# EAGLE design true-bypass (EAGLE 7.3.0)
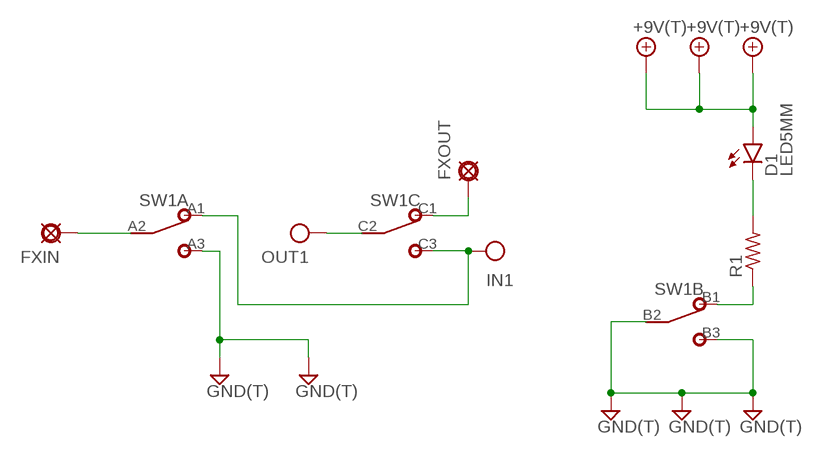
[diagram p0: schematic, sheet 1]

## Parts
+9V1  +9V(T)  [SQUARE]
+9V2  +9V(T)  [SQUARE]
+9V3  +9V(T)  [SQUARE]
D1  LED5MM  [LED5MM]
FXIN  PAD  [SQUARE]
FXOUT  PAD  [SQUARE]
GND1  GND(T)  [SQUARE]
GND2  GND(T)  [SQUARE]
GND3  GND(T)  [SQUARE]
GND4  GND(T)  [SQUARE]
GND5  GND(T)  [SQUARE]
IN1  IN(T)  [SQUARE]
OUT1  OUT(T)  [SQUARE]
R1  6MM.3  [R0207/3]
SW1  3PDTBLUE  [CHINABLUE]

## Nets
+9V: +9V1.1(+9V) +9V2.1(+9V) +9V3.1(+9V) D1.A
GND: GND1.1(GND) GND2.1(GND) GND3.1(GND) GND4.1(GND) GND5.1(GND) SW1.A3 SW1.B2 SW1.B3
IN: IN1.1(IN) SW1.A1 SW1.C3
N$1: FXIN.1(PAD) SW1.A2
N$2: D1.K(C) R1.2
N$3: R1.1 SW1.B1
N$4: FXOUT.1(PAD) SW1.C1
OUT: OUT1.1(OUT) SW1.C2

## Library data of the parts
+9V1-+9V3 = gm-supply:+9V(T): +9V Voltage Supply use this to hook up +9v throughout a schematic instead of running wire automatically labels the net "+9v" adds a hookup pad to the circuit board
D1 = gm-diodes:LED
FXIN FXOUT = gm-supply:PAD: PAD use this package for pads with any purpose, including input, output, send or return various pad shapes: round, square, octogonal, long, and long offset
GND1-GND5 = gm-supply:GND(T): Ground use this to hook up ground (GND) throughout a schematic instead of running wire automatically labels the net "GND" adds a hookup pad to the circuit board (you can use several)
IN1 = gm-supply:IN(T): Input obsolete: use Pad instead and label net shematic input label with circuit board terminal/pad generally used only once on a schematic (because this device labels the net "IN" in the same way as a voltage supply or ground net)
OUT1 = gm-supply:OUT(T): Output obsolete: use Pad instead and label net output label with circuit board terminal/pad usually appears only once on a schematic
R1 = gm-resistors:6MM: 6mm Resistors Leads spaced 1-6 holes apart for 0.1" perfboard. Suitable for 1/4 watt resistors.
SW1 = gm-switches:3PDT

## Board
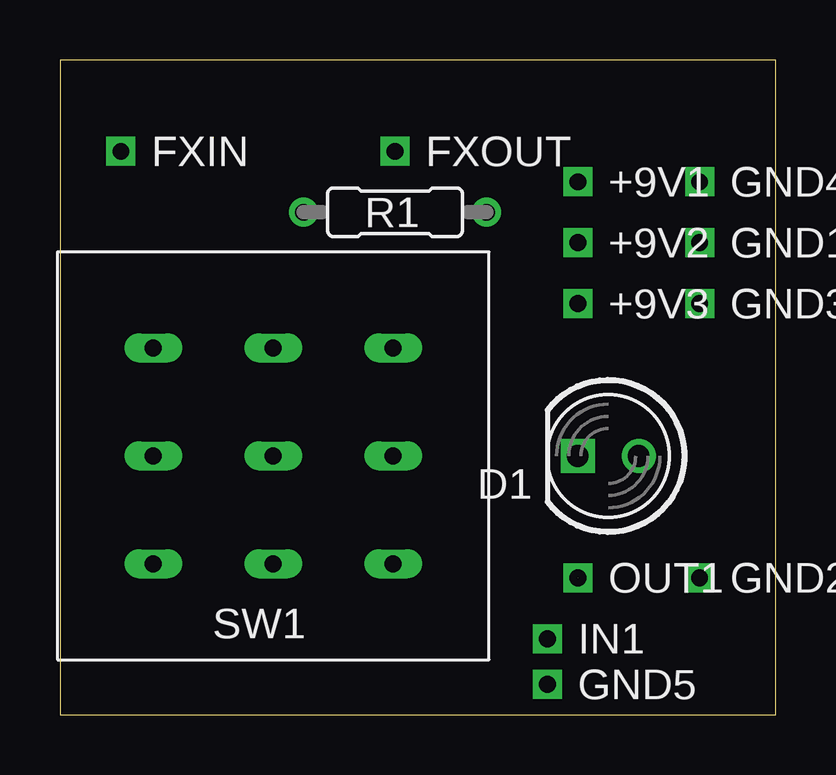
[diagram p1: board, top side]
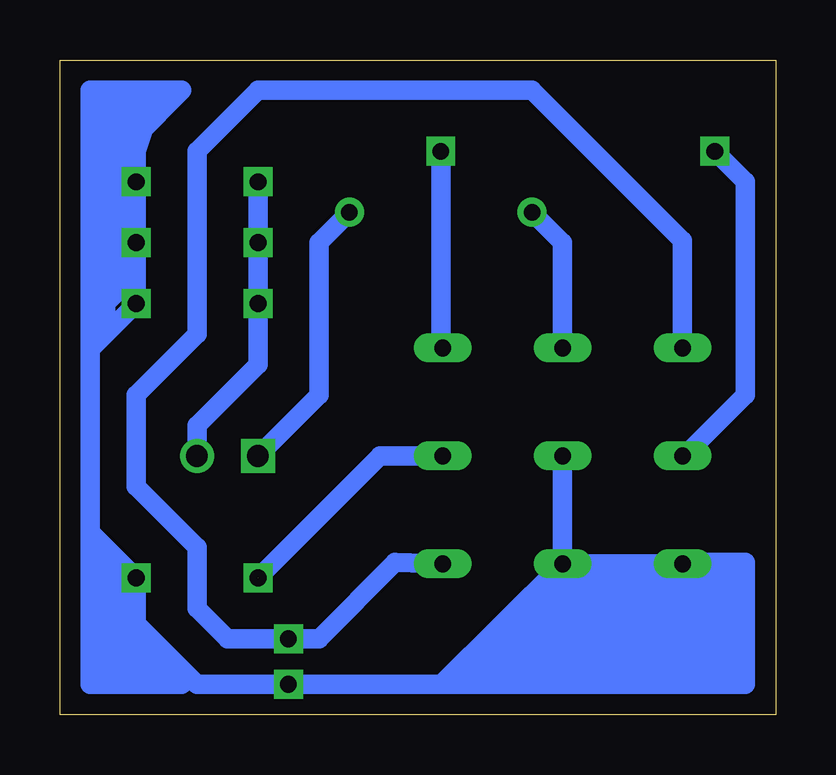
[diagram p2: board, bottom side, seen from below]

Size 29.84 x 27.3 mm. Coordinates in mm from the lower left corner, seen from the top.
Outline: 0,0 29.84,0 29.84,27.3 0,27.3 0,0
Copper layers (1*16): Top 0.035mm / dielectric 1.5mm / Bottom 0.035mm
Design rules "default": minimum track width 10mil, minimum drill 24mil, track to track 8mil, track to pad 8mil, pad to pad 8mil, via to via 8mil, smd to smd 8mil, copper to edge 40mil, drill to drill 8mil, minimum pad ring 10mil, minimum via ring 8mil, stop-mask expansion 4mil, vias tented up to drill 0mil, thermal gap 10mil

### Footprints (pad centres in the part's own frame; a part is rotated, then mirrored left to right if it is on the bottom)
SQUARE = drill 0.7 square: 1 0,0
LED5MM = drill 0.9: A -1.27,0 | drill 0.9 square: K 1.27,0
R0207/3 = drill 0.7: 1 -3.81,0; 2 3.81,0
CHINABLUE = drill 0.7 long: A1 -5,4.5; A2 -5,0; A3 -5,-4.5; B1 0,4.5; B2 0,0; B3 0,-4.5; C1 5,4.5; C2 5,0; C3 5,-4.5

### Placement (x,y rotation side)
+9V1  21.59,22.23 0 top
+9V2  21.59,19.68 0 top
+9V3  21.59,17.14 0 top
D1  22.86,10.79 180 top
FXIN  2.54,23.5 0 top
FXOUT  13.97,23.5 0 top
GND1  26.67,19.68 0 top
GND2  26.67,5.71 0 top
GND3  26.67,17.14 0 top
GND4  26.67,22.23 0 top
GND5  20.32,1.27 0 top
IN1  20.32,3.17 0 top
OUT1  21.59,5.71 0 top
R1  13.97,20.95 0 top
SW1  8.89,10.79 0 top

### Tracks (layer width: path | path; a pad name or v marks a point on that pad's centre or on a via)
+9V
  Bottom 0.813: +9V1.1 +9V2.1 +9V3.1 21.59,14.61 24.13,12.06 D1.A
GND
  Bottom 0.813: SW1.B2 SW1.B3 | SW1.A3 SW1.B3 | GND4.1 GND1.1 | GND1.1 GND3.1 28.57,15.24 | 28.57,15.24 28.57,7.62 | GND1.1 26.67,23.5 | 26.67,23.5 26.67,24.13 | 26.67,24.13 24.77,26.04 26.67,26.04 | 26.67,26.04 26.67,24.77 | 26.67,24.77 26.67,24.13 | 26.67,23.5 26.04,25.4 26.67,24.77 | 26.67,26.04 28.57,26.04 28.57,16.51 | 28.57,15.24 28.57,16.51 | 28.57,16.51 27.3,17.78 27.3,25.4 27.94,25.4 27.94,16.51 | 28.57,7.62 GND2.1 26.67,3.81 24.13,1.27 GND5.1 13.97,1.27 | SW1.B3 13.97,1.27 | 24.77,1.27 28.57,1.27 28.57,6.99 | 28.57,6.99 27.3,5.71 27.3,3.81 26.67,3.17 | 26.67,3.17 25.4,1.91 27.94,1.91 27.94,3.81 | 27.94,5.71 27.94,3.81 | 27.94,3.81 26.67,2.54 27.3,2.54 26.67,3.17 | 28.57,6.99 28.57,7.62 | 13.97,1.27 3.81,1.27 | 3.81,5.08 3.81,5.71 8.89,5.71 12.7,1.91 4.45,1.91 4.45,5.08 8.26,5.08 8.89,4.45 | 8.89,4.45 9.53,4.45 11.43,2.54 5.08,2.54 5.08,4.45 8.26,4.45 | 8.26,4.45 8.89,5.08 8.89,4.45 | 8.89,4.45 10.16,3.17 5.71,3.17 5.71,3.81 8.89,3.81 8.26,4.45 | 3.81,6.35 1.27,6.35 1.27,1.27 3.81,1.27 | 3.81,1.27 3.81,5.08 | 3.81,5.08 3.17,5.71 1.91,5.71 1.91,1.91 2.54,1.91 | 2.54,1.91 3.17,1.91 3.17,5.08 2.54,5.08 2.54,1.91
IN
  Bottom 0.813: SW1.A1 3.89,19.77 10.16,26.04 21.59,26.04 24.13,23.5 24.13,15.88 26.67,13.34 26.67,9.53 24.13,6.99 24.13,4.45 22.86,3.17 IN1.1 19.05,3.17 15.88,6.35 SW1.C3
N$1
  Bottom 0.813: SW1.A2 3.81,10.79 1.27,13.34 1.27,22.23 FXIN.1
N$2
  Bottom 0.813: R1.2 19.05,19.68 19.05,13.34 D1.K
N$3
  Bottom 0.813: R1.1 8.89,19.68 SW1.B1
N$4
  Bottom 0.813: FXOUT.1 13.97,15.38 SW1.C1
OUT  (1 unrouted)
  Bottom 0.813: SW1.C2 16.51,10.79 OUT1.1